# Altium schematic sheet MCU.SchDoc
size A4
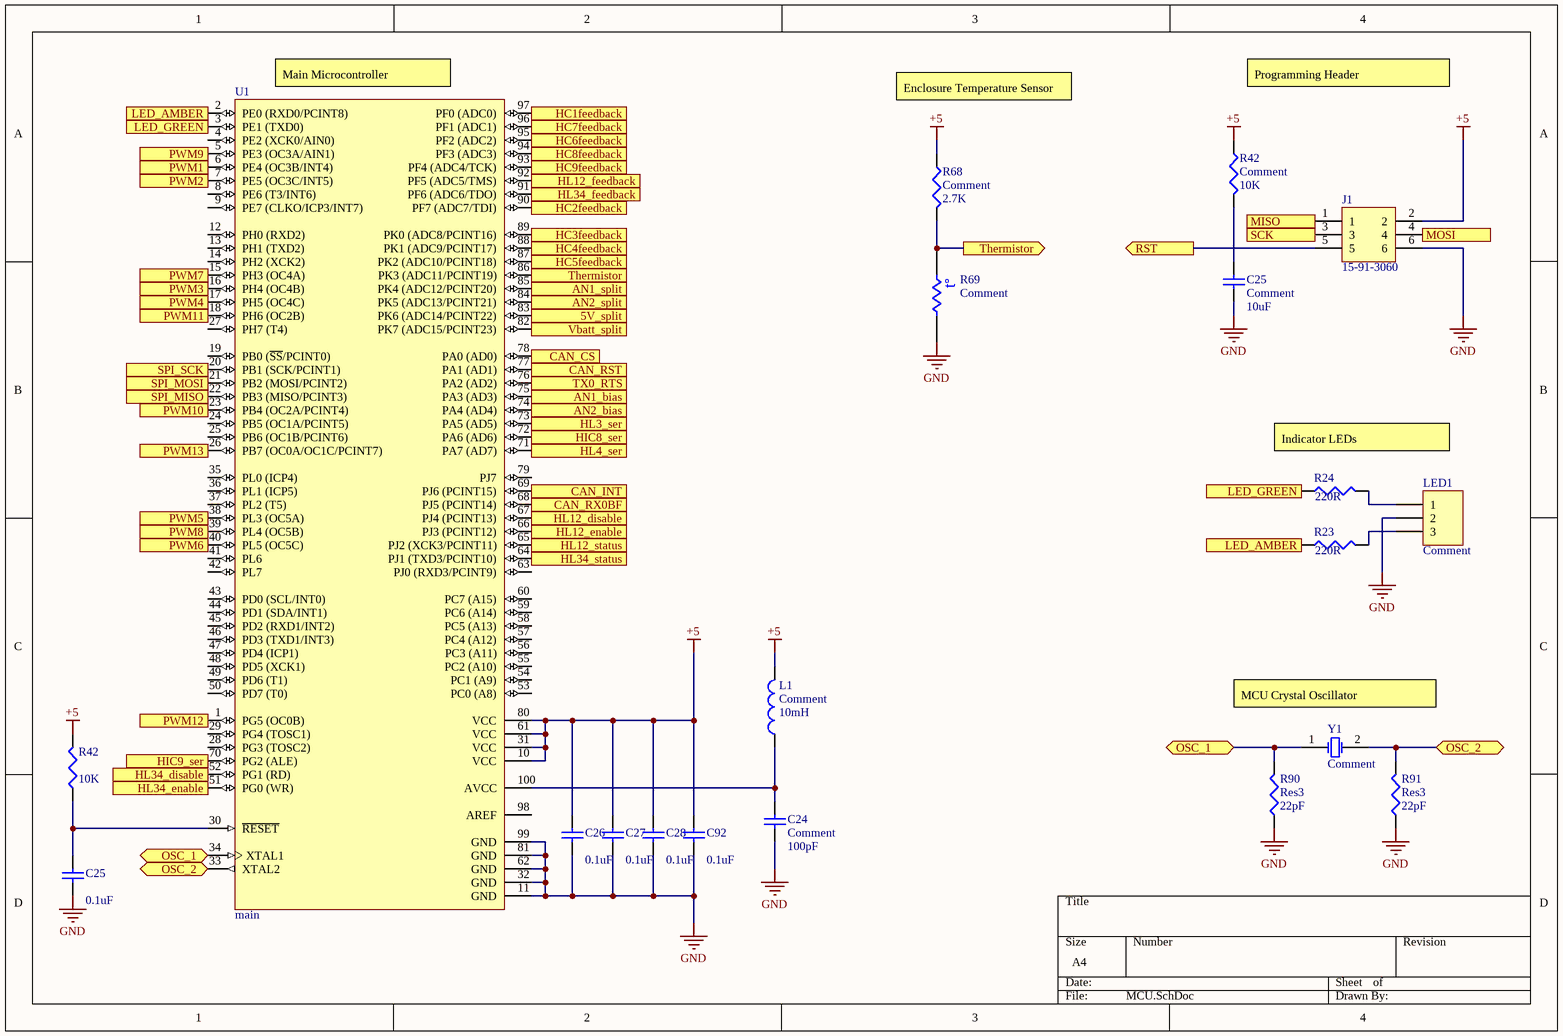
[diagram p0: MCU.SchDoc]

## Parts
(Parts that share a designator on the sheet are numbered #1, #2 ... from top to bottom, then left to right.)
C24  Comment  value 100pF  [J1-0603]
C25#1  Comment  value 10uF  [J1-0603]
C25#2  value 0.1uF  [0402]  (hidden comment: Cap Semi)
C26  value 0.1uF  [J1-0603]  (hidden comment: Comment)
C27  value 0.1uF  [J1-0603]  (hidden comment: Comment)
C28  value 0.1uF  [J1-0603]  (hidden comment: Comment)
C92  value 0.1uF  [J1-0603]  (hidden comment: Comment)
J1  15-91-3060  [SOT23-6]
L1  Comment  value 10mH  [2012[0805]]
LED1  Comment  [369-03]
R23  value 220R  [2012[0805]]  (hidden comment: Comment)
R24  value 220R  [2012[0805]]  (hidden comment: Comment)
R42#1  Comment  value 10K  [2012[0805]]
R42#2  value 10K  [12Z-2010]  (hidden comment: Res3)
R68  Comment  value 2.7K  [2012[0805]]
R69  Comment  [2012[0805]]
R90  Res3  value 22pF  [12Z-2010]
R91  Res3  value 22pF  [J1-0603]
U1  main  [SOT407-1_L]
Y1  Comment  [2012[0805]]

## Ports
5V_split (in), AN1_bias, AN1_split (in), AN2_bias, AN2_split (in), CAN_CS (out), CAN_INT (in), CAN_RST (out), CAN_RX0BF (in), HC1feedback (in), HC2feedback (in), HC3feedback (in), HC4feedback (in), HC5feedback (in), HC6feedback (in), HC7feedback (in), HC8feedback (in), HC9feedback (in), HIC8_ser, HIC9_ser, HL3_ser, HL4_ser, HL12_disable (out), HL12_enable (out), HL12_feedback (in), HL12_status (in), HL34_disable (out), HL34_enable (out), HL34_feedback (in), HL34_status (in), LED_AMBER (in), LED_AMBER (out), LED_GREEN (in), LED_GREEN (out), MISO (in), MOSI (out), OSC_1 (bidir), OSC_2 (bidir), PWM1 (out), PWM2 (out), PWM3 (out), PWM4 (out), PWM5 (out), PWM6 (out), PWM7 (out), PWM8 (out), PWM9 (out), PWM10 (out), PWM11 (out), PWM12 (out), PWM13 (out), RST (out), SCK (out), SPI_MISO (in), SPI_MOSI (out), SPI_SCK, Thermistor (in), Thermistor (out), TX0_RTS, Vbatt_split (in)

## Nets
+5: C26.2 C27.2 C28.2 C92.1 J1.2 L1.1 R42#1.1 R42#2.2 R68.2 U1.10(VCC) U1.31(VCC) U1.61(VCC) U1.80(VCC)
GND: C24.1 C25#1.1 C25#2.1 C26.1 C27.1 C28.1 C92.2 J1.6 LED1.2 R69.2 R90.1 R91.1 U1.11(GND) U1.32(GND) U1.62(GND) U1.81(GND) U1.99(GND)
5V_split: U1.83(PK6_(ADC14/PCINT22)) ; port 5V_split
AN1_bias: U1.75(PA3_(AD3)) ; port AN1_bias
AN1_split: U1.85(PK4_(ADC12/PCINT20)) ; port AN1_split
AN2_bias: U1.74(PA4_(AD4)) ; port AN2_bias
AN2_split: U1.84(PK5_(ADC13/PCINT21)) ; port AN2_split
CAN_CS: U1.78(PA0_(AD0)) ; port CAN_CS
CAN_INT: U1.69(PJ6_(PCINT15)) ; port CAN_INT
CAN_RST: U1.77(PA1_(AD1)) ; port CAN_RST
CAN_RX0BF: U1.68(PJ5_(PCINT14)) ; port CAN_RX0BF
HC1feedback: U1.97(PF0_(ADC0)) ; port HC1feedback
HC2feedback: U1.90(PF7_(ADC7/TDI)) ; port HC2feedback
HC3feedback: U1.89(PK0_(ADC8/PCINT16)) ; port HC3feedback
HC4feedback: U1.88(PK1_(ADC9/PCINT17)) ; port HC4feedback
HC5feedback: U1.87(PK2_(ADC10/PCINT18)) ; port HC5feedback
HC6feedback: U1.95(PF2_(ADC2)) ; port HC6feedback
HC7feedback: U1.96(PF1_(ADC1)) ; port HC7feedback
HC8feedback: U1.94(PF3_(ADC3)) ; port HC8feedback
HC9feedback: U1.93(PF4_(ADC4/TCK)) ; port HC9feedback
HIC8_ser: U1.72(PA6_(AD6)) ; port HIC8_ser
HIC9_ser: U1.70(PG2_(ALE)) ; port HIC9_ser
HL3_ser: U1.73(PA5_(AD5)) ; port HL3_ser
HL4_ser: U1.71(PA7_(AD7)) ; port HL4_ser
HL12_disable: U1.67(PJ4_(PCINT13)) ; port HL12_disable
HL12_enable: U1.66(PJ3_(PCINT12)) ; port HL12_enable
HL12_feedback: U1.92(PF5_(ADC5/TMS)) ; port HL12_feedback
HL12_status: U1.65(PJ2_(XCK3/PCINT11)) ; port HL12_status
HL34_disable: U1.52(PG1_(RD)) ; port HL34_disable
HL34_enable: U1.51(PG0_(WR)) ; port HL34_enable
HL34_feedback: U1.91(PF6_(ADC6/TDO)) ; port HL34_feedback
HL34_status: U1.64(PJ1_(TXD3/PCINT10)) ; port HL34_status
LED_AMBER: R23.1 U1.2(PE0_(RXD0/PCINT8)) ; port LED_AMBER
LED_GREEN: R24.1 U1.3(PE1_(TXD0)) ; port LED_GREEN
MISO: J1.1 ; port MISO
MOSI: J1.4 ; port MOSI
OSC_1: R90.2 U1.34(XTAL1) Y1.1(OSC1) ; port OSC_1
OSC_2: R91.2 U1.33(XTAL2) Y1.2(OSC2) ; port OSC_2
PWM1: U1.6(PE4_(OC3B/INT4)) ; port PWM1
PWM2: U1.7(PE5_(OC3C/INT5)) ; port PWM2
PWM3: U1.16(PH4_(OC4B)) ; port PWM3
PWM4: U1.17(PH5_(OC4C)) ; port PWM4
PWM5: U1.38(PL3_(OC5A)) ; port PWM5
PWM6: U1.40(PL5_(OC5C)) ; port PWM6
PWM7: U1.15(PH3_(OC4A)) ; port PWM7
PWM8: U1.39(PL4_(OC5B)) ; port PWM8
PWM9: U1.5(PE3_(OC3A/AIN1)) ; port PWM9
PWM10: U1.23(PB4_(OC2A/PCINT4)) ; port PWM10
PWM11: U1.18(PH6_(OC2B)) ; port PWM11
PWM12: U1.1(PG5_(OC0B)) ; port PWM12
PWM13: U1.26(PB7_(OC0A/OC1C/PCINT7)) ; port PWM13
RST: J1.5 ; port RST
SCK: J1.3 ; port SCK
SPI_MISO: U1.22(PB3_(MISO/PCINT3)) ; port SPI_MISO
SPI_MOSI: U1.21(PB2_(MOSI/PCINT2)) ; port SPI_MOSI
SPI_SCK: U1.20(PB1_(SCK/PCINT1)) ; port SPI_SCK
Thermistor: R68.1 R69.1 U1.86(PK3_(ADC11/PCINT19)) ; port Thermistor
TX0_RTS: U1.76(PA2_(AD2)) ; port TX0_RTS
Vbatt_split: U1.82(PK7_(ADC15/PCINT23)) ; port Vbatt_split
NetC24_2: C24.2 L1.2 U1.100(AVCC)
NetC25#1_2: C25#1.2 R42#1.2
NetC25#2_2: C25#2.2 R42#2.1 U1.30(~{RESET})
NetLED1_1: LED1.1 R24.2
NetLED1_3: LED1.3 R23.2

Not connected (* = marked no-connect by the designer): U1 4(PE2_(XCK0/AIN0)) 8(PE6_(T3/INT6)) 9(PE7_(CLKO/ICP3/INT7)) 12(PH0_(RXD2)) 13(PH1_(TXD2)) 14(PH2_(XCK2)) 19(PB0_(~{SS}/PCINT0)) 24(PB5_(OC1A/PCINT5)) 25(PB6_(OC1B/PCINT6)) 27(PH7_(T4)) 28(PG3_(TOSC2)) 29(PG4_(TOSC1)) 35(PL0_(ICP4)) 36(PL1_(ICP5)) 37(PL2_(T5)) 41(PL6) 42(PL7) 43(PD0_(SCL/INT0)) 44(PD1_(SDA/INT1)) 45(PD2_(RXD1/INT2)) 46(PD3_(TXD1/INT3)) 47(PD4_(ICP1)) 48(PD5_(XCK1)) 49(PD6_(T1)) 50(PD7_(T0)) 53(PC0_(A8)) 54(PC1_(A9)) 55(PC2_(A10)) 56(PC3_(A11)) 57(PC4_(A12)) 58(PC5_(A13)) 59(PC6_(A14)) 60(PC7_(A15)) 63(PJ0_(RXD3/PCINT9)) 79(PJ7) 98(AREF)

## Notes on the sheet
- (near U1) Main Microcontroller
- Enclosure Temperature Sensor
- Programming Header
- Indicator LEDs
- (near Y1) MCU Crystal Oscillator
- (in symbol Res Thermal) t°

## Library data of the parts
C24 C25#1 C25#2 C26-C28 C92 = Cap Semi: Capacitor (Semiconductor SIM Model); Published: 8-Jun-2000; LatestRevisionDate: 29-May-2009; LatestRevisionNote: IPC-7351 Footprint Added.; PackageReference: C1206; Publisher: Altium Limited; PackageDescription: Chip Capacitor
J1 = Header 3X2: Header, 3-Pin, Dual row; LatestRevisionDate: 17-Jul-2002; LatestRevisionNote: Re-released for DXP Platform.; Publisher: Altium Limited
L1 = Inductor: Code_IEC: 1005; Published: 8-Jun-2000; LatestRevisionDate: 29-May-2009; LatestRevisionNote: IPC-7351 Footprint Added.; PackageReference: 0402-A; Publisher: Altium Limited; PackageDescription: Chip Inductor; Code_JEITA: 0402
LED1 = Header 3: Header, 3-Pin; LatestRevisionDate: 17-Jul-2002; LatestRevisionNote: Re-released for DXP Platform.; Publisher: Altium Limited
R23 R24 R42#1 R42#2 R68 R90 R91 = Res3: Resistor; Published: 8-Jun-2000; LatestRevisionDate: 29-May-2009; LatestRevisionNote: IPC-7351 Footprint Added.; PackageReference: J1-0603; Publisher: Altium Limited; PackageDescription: Chip Resistor
R69 = Res Thermal: Published: 24-Mar-1999; LatestRevisionDate: 29-May-2009; LatestRevisionNote: IPC-7351 Footprint Added.; PackageVersion: Mar-2003; PackageReference: 6-0805; Publisher: Altium Limited; PackageDescription: Chip Resistor 0805 Case Size; Code_IPC: RESC2012
U1 = CMP-0095-00211-2: 8-bit AVR Microcontroller, 2.7-5.5V, 8MHz, 128KB Flash, 4KB EEPROM, 8KB SRAM, 86 GPIO pins, 100-pin TQFP, Industrial Grade (-40°C to 85°C), Pb-Free; PackageReference: 100A; DatasheetVersion: revN, May-2011; PackageVersion: revD, Oct-2010; Code_JEDEC: MS-026-AED; ComponentLink2URL: http://www.atmel.com/dyn/resources/prod_documents/doc2549.pdf; ComponentLink1Description: Manufacturer URL; ComponentLink2Description: ATmega640/1280/1281/2560/2561 Datasheet; ComponentLink3Description: ATmega640/1280/1281/2560/2561 Summary; RevisionNote: DatasheetVersion & PackageVersion updated. URLs added.; ComponentLink3URL: http://www.atmel.com/dyn/resources/prod_documents/2549S.pdf; ComponentLink1URL: http://www.atmel.com/; PackageDescription: 100-Pin Thin Profile Plastic Quad Flat Pack (TQFP), 14 x 14 x 1.0 mm Body, 0.5 mm Pitch
Y1 = XTAL: Crystal Oscillator; Published: 8-Jun-2000; LatestRevisionDate: 17-Jul-2002; LatestRevisionNote: Re-released for DXP Platform.; PackageReference: R38; Publisher: Altium Limited; PackageDescription: Crystal, Thru-Hole; 2 Leads; Body 3.1 x 8.2 mm (Dia.xH)